# Altium schematic sheet cellular_modem.SchDoc: Edison Gateway - Cellular
size Letter; Author: Ye-Sheng Kuo; DocumentNumber: 10; Revision: 3; SheetNumber: 10; SheetTotal: 10
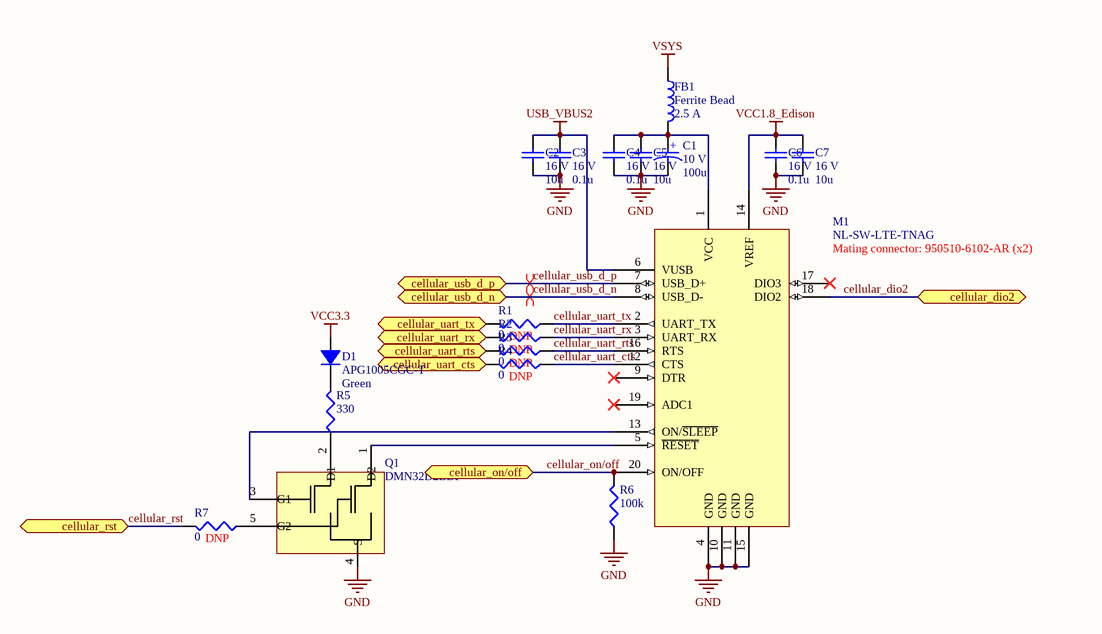
[diagram p0: cellular_modem.SchDoc]

## Parts
C1  voltage rated: 10 V  [1206 - POLAR MARKING]  (hidden comment: 100u)
C2  voltage rated: 16 V  [0603]  (hidden comment: 10u)
C3  voltage rated: 16 V  [0402]  (hidden comment: 0.1u)
C4  voltage rated: 16 V  [0402]  (hidden comment: 0.1u)
C5  voltage rated: 16 V  [0603]  (hidden comment: 10u)
C6  voltage rated: 16 V  [0402]  (hidden comment: 0.1u)
C7  voltage rated: 16 V  [0603]  (hidden comment: 10u)
D1  APG1005CGC-T  value Green  [0402 - LED]
FB1  Ferrite Bead  Current Rating (Max): 2.5 A  [0603]
M1  NL-SW-LTE-TNAG  Note: Mating connector: 950510-6102-AR (x2)  [skywire]
Q1  DMN32D2LDF  [SOT-353-5]
R1  Note: DNP  [0402]  (hidden comment: 0)
R2  Note: DNP  [0402]  (hidden comment: 0)
R3  Note: DNP  [0402]  (hidden comment: 0)
R4  Note: DNP  [0402]  (hidden comment: 0)
R5  330  [0402]
R6  100k  [0402]
R7  Note: DNP  [0402]  (hidden comment: 0)

## Ports
cellular_dio2, cellular_on/off, cellular_rst, cellular_uart_cts, cellular_uart_rts, cellular_uart_rx, cellular_uart_tx, cellular_usb_d_n, cellular_usb_d_p

## Nets
GND: C1.2 C2.2 C3.2 C4.2 C5.2 C6.2 C7.2 M1.4(GND) M1.10(GND) M1.11(GND) M1.15(GND) Q1.4(S) R6.2
USB_VBUS2: C2.1 C3.1 M1.6(VUSB)
VCC1.8_Edison: C6.1 C7.1 M1.14(VREF)
VCC3.3: D1.1
VSYS: FB1.2
cellular_dio2: M1.18(DIO2) ; port cellular_dio2
cellular_on/off: M1.20(ON/OFF) R6.1 ; port cellular_on/off
cellular_rst: R7.1 ; port cellular_rst
cellular_uart_cts: M1.12(CTS) R4.2
cellular_uart_cts: R4.1 ; port cellular_uart_cts  [a separate net that carries the same name]
cellular_uart_rts: M1.16(RTS) R3.2
cellular_uart_rts: R3.1 ; port cellular_uart_rts  [a separate net that carries the same name]
cellular_uart_rx: M1.3(UART_RX) R2.2
cellular_uart_rx: R2.1 ; port cellular_uart_rx  [a separate net that carries the same name]
cellular_uart_tx: M1.2(UART_TX) R1.2
cellular_uart_tx: R1.1 ; port cellular_uart_tx  [a separate net that carries the same name]
cellular_usb_d_n: M1.8(USB_D-) ; port cellular_usb_d_n
cellular_usb_d_p: M1.7(USB_D+) ; port cellular_usb_d_p
NetC1_1: C1.1 C4.1 C5.1 FB1.1 M1.1(VCC)
NetD1_2: D1.2 R5.1
NetM1_5: M1.5(~{RESET}) Q1.1(D2)
NetM1_13: M1.13(ON/~{SLEEP}) Q1.3(G1)
NetQ1_2: Q1.2(D1) R5.2
NetQ1_5: Q1.5(G2) R7.2

Not connected (* = marked no-connect by the designer): M1 9(DTR)* 17(DIO3)* 19(ADC1)*

## Layout directives
differential pair: cellular_usb_d_n, cellular_usb_d_p

## Notes on the sheet
- Title
- Date:
- Author:
- Revision:
- Sheet
- of
- University of Michigan
- File:
- (in symbol TLNK107M010R2500) +

## Library data of the parts
C1 = TLNK107M010R2500: 100µF ±20% Molded Tantalum Capacitors 10V 1206; Manufacture: AVX; ESR: 2.5 Ohm; tolerance: 20%; package: 1206; Supplier 1: Digi-Key; Supplier Part Number 1: 478-6251-1-ND; Value: 100u; Manufacturer Part Number: TLNK107M010R2500
C2 C5 C7 = GRM188C81C106MA73D: 10µF ±20% 16V Ceramic Capacitor X6S 0603; Manufacture: Murata; tolerance: 20%; package: 0603; Temperature Coefficient: X6S; Supplier 1: Digi-Key; Supplier Part Number 1: 490-7198-1-ND; Value: 10u; Manufacturer Part Number: GRM188C81C106MA73D
C3 C4 C6 = GRM155R71C104KA88D: 0.10µF ±10% 16V Ceramic Capacitor X7R 0402; Manufacture: Murata; tolerance: 10%; package: 0402; Supplier 1: Digi-Key; Supplier Part Number 1: 490-3261-1-ND; Value: 0.1u; Temperature Coefficient: X7R; Manufacturer Part Number: GRM155R71C104KA88D
D1 = APG1005CGC-T: Green 571nm LED Indication - Discrete 2V 0402 (1005 Metric); Manufacturer: Kingbright; Current @ VF: 20 mA; package: 0402; Forward Voltage: 2 V; Manufacturer Part Number: APG1005CGC-T; Wavelength: 571 nm; Supplier 1: Digi-Key; Supplier Part Number 1: 754-1811-1-ND
FB1 = BLM18SG221TN1D: FERRITE BEAD 220 OHM 0603; Manufacturer: Murata; DC resistance: 40m; Impedance @ Frequency: 220 Ohm @ 100MHz; package: 0603; Supplier 1: Digi-Key; Supplier Part Number 1: 490-5225-1-ND; Manufacturer Part Number: BLM18SG221TN1D
M1 = NL-SW-LTE-TNAG: NimbeLink Skywire cat3, ATT GSM 4G modem
Q1 = DMN32D2LDF: Common Source Dual N-Channel MOSFET; Supplier 1: Digi-Key; Supplier Part Number 1: DMN32D2LDF-7DICT-ND
R1-R4 R7 = CRCW04020000Z0EDHP: RES SMD 0.0 OHM JUMPER 1/5W 0402; Manufacturer: Vishay Dale; Temperature Coefficient: NA; package: 0402; Supplier 1: Digi-Key; Supplier Part Number 1: 541-0.0YBCT-ND; value: 0; Manufacturer Part Number: CRCW04020000Z0EDHP; Power: 1/5 W; Tolerance: NA
R5 = CRCW0402330RFKED: RES SMD 330 OHM 1% 1/16W 0402; Manufacturer: Vishay Dale; Temperature Coefficient: 100 ppm/C; Tolerance: 1%; Power: 1/16 W; package: 0402; Supplier 1: Digi-Key; Supplier Part Number 1: 541-330LCT-ND; value: 330; Manufacturer Part Number: CRCW0402330RFKED
R6 = CRCW0402100KFKED: RES SMD 100K OHM 1% 1/16W 0402; Manufacturer: Vishay Dale; Temperature Coefficient: 100 ppm/C; Tolerance: 1%; Power: 1/16 W; Supplier 1: Digi-Key; Supplier Part Number 1: 541-100KLCT-ND; package: 0402; value: 100k; Manufacturer Part Number: CRCW0402100KFKED